# EAGLE design lpc1343fzr (EAGLE 5.11)
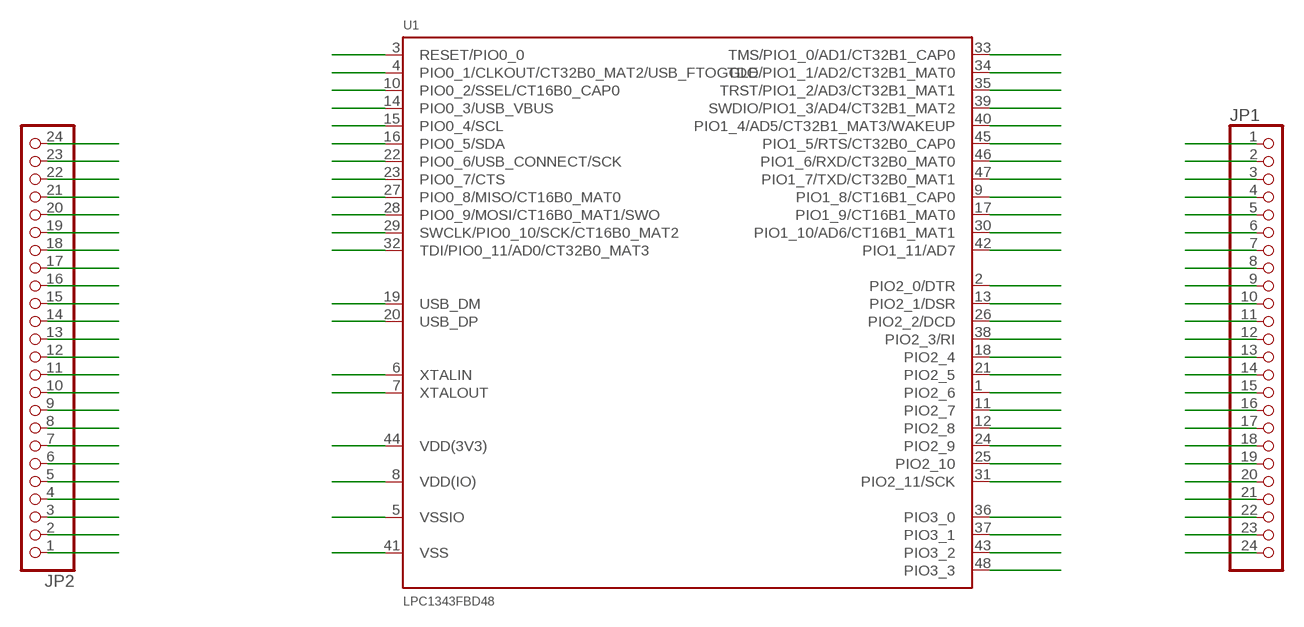
[diagram p0: schematic, sheet 1]

## Parts
JP1  PINHD-1X24  [1X24]
JP2  PINHD-1X24  [1X24]
U1  LPC1343FBD48  LPC1343_QFP  [LQFP48]

## Nets
1: JP2.1 U1.1(PIO2_6)
2: JP2.2 U1.2(PIO2_0/DTR)
3: JP2.3 U1.3(RESET/PIO0_0)
4: JP2.4 U1.4(PIO0_1/CLKOUT/CT32B0_MAT2/USB_FTOGGLE)
5: JP2.5 U1.5(VSSIO)
6: JP2.6 U1.6(XTALIN)
7: JP2.7 U1.7(XTALOUT)
8: JP2.8 U1.8(VDD(IO))
9: JP2.9 U1.9(PIO1_8/CT16B1_CAP0)
10: JP2.10 U1.10(PIO0_2/SSEL/CT16B0_CAP0)
11: JP2.11 U1.11(PIO2_7)
12: JP2.12 U1.12(PIO2_8)
13: JP2.13 U1.13(PIO2_1/DSR)
14: JP2.14 U1.14(PIO0_3/USB_VBUS)
15: JP2.15 U1.15(PIO0_4/SCL)
16: JP2.16 U1.16(PIO0_5/SDA)
17: JP2.17 U1.17(PIO1_9/CT16B1_MAT0)
18: JP2.18 U1.18(PIO2_4)
19: JP2.19 U1.19(USB_DM)
20: JP2.20 U1.20(USB_DP)
21: JP2.21 U1.21(PIO2_5)
22: JP2.22 U1.22(PIO0_6/USB_CONNECT/SCK)
23: JP2.23 U1.23(PIO0_7/CTS)
24: JP2.24 U1.24(PIO2_9)
25: JP1.1 U1.25(PIO2_10)
26: JP1.2 U1.26(PIO2_2/DCD)
27: JP1.3 U1.27(PIO0_8/MISO/CT16B0_MAT0)
28: JP1.4 U1.28(PIO0_9/MOSI/CT16B0_MAT1/SWO)
29: JP1.5 U1.29(SWCLK/PIO0_10/SCK/CT16B0_MAT2)
30: JP1.6 U1.30(PIO1_10/AD6/CT16B1_MAT1)
31: JP1.7 U1.31(PIO2_11/SCK)
32: JP1.8 U1.32(TDI/PIO0_11/AD0/CT32B0_MAT3)
33: JP1.9 U1.33(TMS/PIO1_0/AD1/CT32B1_CAP0)
34: JP1.10 U1.34(TDO/PIO1_1/AD2/CT32B1_MAT0)
35: JP1.11 U1.35(TRST/PIO1_2/AD3/CT32B1_MAT1)
36: JP1.12 U1.36(PIO3_0)
37: JP1.13 U1.37(PIO3_1)
38: JP1.14 U1.38(PIO2_3/RI)
39: JP1.15 U1.39(SWDIO/PIO1_3/AD4/CT32B1_MAT2)
40: JP1.16 U1.40(PIO1_4/AD5/CT32B1_MAT3/WAKEUP)
41: JP1.17 U1.41(VSS)
42: JP1.18 U1.42(PIO1_11/AD7)
43: JP1.19 U1.43(PIO3_2)
44: JP1.20 U1.44(VDD(3V3))
45: JP1.21 U1.45(PIO1_5/RTS/CT32B0_CAP0)
46: JP1.22 U1.46(PIO1_6/RXD/CT32B0_MAT0)
47: JP1.23 U1.47(PIO1_7/TXD/CT32B0_MAT1)
48: JP1.24 U1.48(PIO3_3)

## Library data of the parts
JP1 JP2 = pinhead:PINHD-1X24: PIN HEADER
U1 = microbuilder:LPC1343_QFP: LPC1343 72 MHz 32-bit ARM Cortex-M3 microcontroller. 32 kB Flash, 8 kB SRAM, USB Device Mouser: 771-LPC1343FBD48151 Digikey: 568-4945-ND

## Board
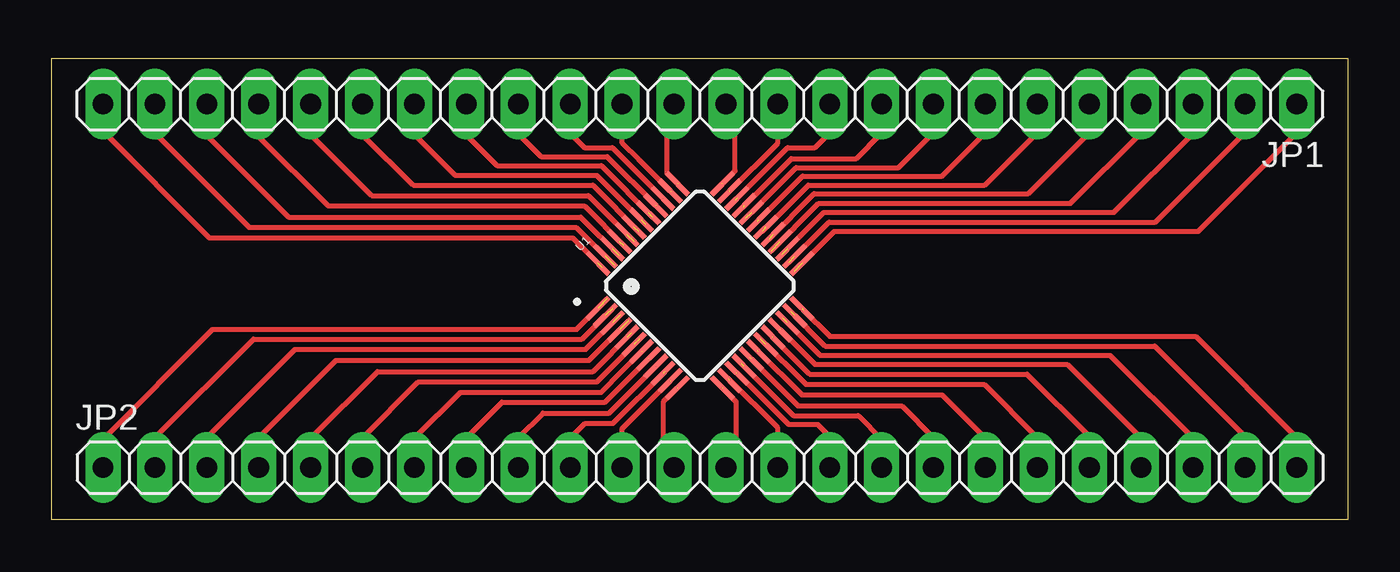
[diagram p1: board, top side]

Size 63.48 x 22.53 mm. Coordinates in mm from the lower left corner, seen from the top.
Outline: 0,0 63.48,0 63.48,22.53 0,22.53 0,0
Copper layers (1*16): Top 0.035mm / dielectric 1.5mm / Bottom 0.035mm
Design rules "default *": minimum track width 10mil, minimum drill 24mil, track to track 8mil, track to pad 8mil, pad to pad 8mil, via to via 8mil, smd to smd 8mil, copper to edge 40mil, drill to drill 8mil, minimum pad ring 10mil, minimum via ring 8mil, stop-mask expansion 4mil, vias tented up to drill 0mil, thermal gap 10mil

### Footprints (pad centres in the part's own frame; a part is rotated, then mirrored left to right if it is on the bottom)
1X24 = drill 1.016 long: 1 -29.21,0; 2 -26.67,0; 3 -24.13,0; 4 -21.59,0; 5 -19.05,0; 6 -16.51,0; 7 -13.97,0; 8 -11.43,0; 9 -8.89,0; 10 -6.35,0; 11 -3.81,0; 12 -1.27,0; 13 1.27,0; 14 3.81,0; 15 6.35,0; 16 8.89,0; 17 11.43,0; 18 13.97,0; 19 16.51,0; 20 19.05,0; 21 21.59,0; 22 24.13,0; 23 26.67,0; 24 29.21,0
LQFP48 = smd 1.5 x 0.25: 1 -4.3,2.75; 2 -4.3,2.25; 3 -4.3,1.75; 4 -4.3,1.25; 5 -4.3,0.75; 6 -4.3,0.25; 7 -4.3,-0.25; 8 -4.3,-0.75; 9 -4.3,-1.25; 10 -4.3,-1.75; 11 -4.3,-2.25; 12 -4.3,-2.75; 25 4.3,-2.75; 26 4.3,-2.25; 27 4.3,-1.75; 28 4.3,-1.25; 29 4.3,-0.75; 30 4.3,-0.25; 31 4.3,0.25; 32 4.3,0.75; 33 4.3,1.25; 34 4.3,1.75; 35 4.3,2.25; 36 4.3,2.75 | smd 0.25 x 1.5: 13 -2.75,-4.3; 14 -2.25,-4.3; 15 -1.75,-4.3; 16 -1.25,-4.3; 17 -0.75,-4.3; 18 -0.25,-4.3; 19 0.25,-4.3; 20 0.75,-4.3; 21 1.25,-4.3; 22 1.75,-4.3; 23 2.25,-4.3; 24 2.75,-4.3; 37 2.75,4.3; 38 2.25,4.3; 39 1.75,4.3; 40 1.25,4.3; 41 0.75,4.3; 42 0.25,4.3; 43 -0.25,4.3; 44 -0.75,4.3; 45 -1.25,4.3; 46 -1.75,4.3; 47 -2.25,4.3; 48 -2.75,4.3

### Placement (x,y rotation side)
JP1  31.75,20.32 180 top
JP2  31.75,2.54 0 top
U1  31.75,11.43 45 top

### Tracks (layer width: path | path; a pad name or v marks a point on that pad's centre or on a via)
1  (1 unrouted)
  Top 0.254: JP2.1 2.54,3.94 7.91,9.3 25.72,9.3 27.21,10.79
2  (1 unrouted)
  Top 0.254: JP2.2 5.08,4 9.91,8.83 25.97,8.83 27.46,10.32
3  (1 unrouted)
  Top 0.254: JP2.3 7.62,4 11.94,8.32 26.16,8.32 27.85,10
4  (1 unrouted)
  Top 0.254: JP2.4 10.16,4 13.94,7.78 26.32,7.78 28.26,9.71
5  (1 unrouted)
  Top 0.254: JP2.5 12.7,3.97 15.97,7.24 26.51,7.24 28.38,9.11
6  (1 unrouted)
  Top 0.254: JP2.6 15.24,4 17.97,6.73 26.7,6.73 28.8,8.83
7  (1 unrouted)
  Top 0.254: JP2.7 17.78,4 20.03,6.22 26.92,6.22 28.89,8.22
8  (1 unrouted)
  Top 0.254: JP2.8 20.32,4 22.07,5.75 27.11,5.75 29.24,7.87
9  (1 unrouted)
  Top 0.254: JP2.9 22.86,4 24.07,5.21 27.31,5.21 29.59,7.49
10  (1 unrouted)
  Top 0.254: JP2.10 25.4,3.97 26.13,4.7 27.5,4.7 30.04,7.24
11  (1 unrouted)
  Top 0.254: JP2.11 27.94,4.45 U1.11
12  (1 unrouted)
  Top 0.254: 30.67,6.45 30.64,6.45 29.97,5.78 29.97,3.05 JP2.12
13  (1 unrouted)
  Top 0.254: 32.83,6.45 33.53,5.75 33.53,3.05 JP2.13
14  (1 unrouted)
  Top 0.254: JP2.14 35.56,4.48 33.15,6.89
15  (1 unrouted)
  Top 0.254: 33.53,7.18 33.56,7.18 36.1,4.63 37.53,4.63 38.07,4.1 38.07,2.57 JP2.15
16  (1 unrouted)
  Top 0.254: JP2.16 40.64,3.94 39.5,5.08 36.32,5.08 33.78,7.62
17  (1 unrouted)
  Top 0.254: JP2.17 43.18,4 41.62,5.56 36.54,5.56 34.2,7.91
18  (1 unrouted)
  Top 0.254: JP2.18 45.72,3.97 43.59,6.1 36.74,6.1 34.58,8.26
19  (1 unrouted)
  Top 0.254: JP2.19 48.26,4 45.66,6.6 36.93,6.6 34.7,8.83
20  (1 unrouted)
  Top 0.254: JP2.20 50.8,4.06 47.75,7.11 37.12,7.11 35.31,8.92
21  (1 unrouted)
  Top 0.254: JP2.21 53.34,3.97 49.72,7.59 37.37,7.59 U1.21
22  (1 unrouted)
  Top 0.254: JP2.22 55.88,3.97 51.82,8.03 37.62,8.03 35.81,9.84
23  (1 unrouted)
  Top 0.254: JP2.23 58.42,4.06 54.01,8.48 37.88,8.48 36.2,10.16
24  (1 unrouted)
  Top 0.254: JP2.24 60.96,4 56.01,8.95 38.1,8.95 36.8,10.25
25  (1 unrouted)
  Top 0.254: JP1.1 60.96,18.92 56.13,14.1 38.32,14.1 36.35,12.13
26  (1 unrouted)
  Top 0.254: JP1.2 58.42,18.92 54.04,14.54 38.07,14.54 36.1,12.57
27  (1 unrouted)
  Top 0.254: JP1.3 55.88,18.89 52.01,15.02 37.81,15.02 35.75,12.95
28  (1 unrouted)
  Top 0.254: JP1.4 53.34,18.92 49.88,15.46 37.56,15.46 35.24,13.14
29  (1 unrouted)
  Top 0.254: JP1.5 50.8,18.92 47.82,15.94 37.34,15.94 35.12,13.72
30  (1 unrouted)
  Top 0.254: JP1.6 48.26,18.92 45.69,16.35 37.05,16.35 34.8,14.1
31  (1 unrouted)
  Top 0.254: JP1.7 45.72,18.92 43.59,16.8 36.77,16.8 34.54,14.57
32  (1 unrouted)
  Top 0.254: JP1.8 43.18,18.92 41.47,17.21 36.45,17.21 33.97,14.73
33  (1 unrouted)
  Top 0.254: JP1.9 40.64,18.89 39.4,17.65 36.23,17.65 33.85,15.27 | 33.85,15.27
34  (1 unrouted)
  Top 0.254: JP1.10 38.1,18.92 37.37,18.19 36.04,18.19 33.46,15.62
35  (1 unrouted)
  Top 0.254: JP1.11 35.56,18.41 33.18,16.03
36  (1 unrouted)
  Top 0.254: 32.83,16.41 33.46,17.05 33.46,19.88 JP1.12
37  (1 unrouted)
  Top 0.254: 30.67,16.41 30.13,16.95 30.13,19.97 JP1.13
38  (1 unrouted)
  Top 0.254: 29.81,16.54 30.32,16.03 | 29.81,16.54 | 28.77,17.59 29.81,16.54 | 28.77,17.59 | 28.77,17.59 27.94,18.41 JP1.14 | JP1.14
39  (1 unrouted)
  Top 0.254: U1.39 27.46,18.19 26.1,18.19 25.46,18.83 25.46,20.26 JP1.15
40  (1 unrouted)
  Top 0.254: 29.59,15.37 27.21,17.75 23.97,17.75 22.96,18.76 22.96,20.19 22.86,20.29 JP1.16
41  (1 unrouted)
  Top 0.254: JP1.17 20.32,18.8 21.81,17.3 26.92,17.3 29.43,14.79
42  (1 unrouted)
  Top 0.254: JP1.18 17.78,18.83 19.78,16.83 26.7,16.83 29.12,14.41
43  (1 unrouted)
  Top 0.254: JP1.19 15.24,18.8 17.72,16.35 26.51,16.35 28.77,14.06
44  (1 unrouted)
  Top 0.254: JP1.20 12.7,18.83 15.68,15.84 26.29,15.84 28.54,13.59
45  (1 unrouted)
  Top 0.254: JP1.21 10.16,18.73 13.56,15.33 26.1,15.33 28.04,13.4
46  (1 unrouted)
  Top 0.254: JP1.22 7.62,18.8 11.62,14.79 25.91,14.79 27.81,12.89
47  (1 unrouted)
  Top 0.254: JP1.23 5.08,18.92 9.68,14.29 25.69,14.29 27.56,12.45
48  (1 unrouted)
  Top 0.254: JP1.24 2.54,18.99 7.75,13.78 25.53,13.78 26.99,12.32